# EAGLE design watch_dev (EAGLE 7.0.0)
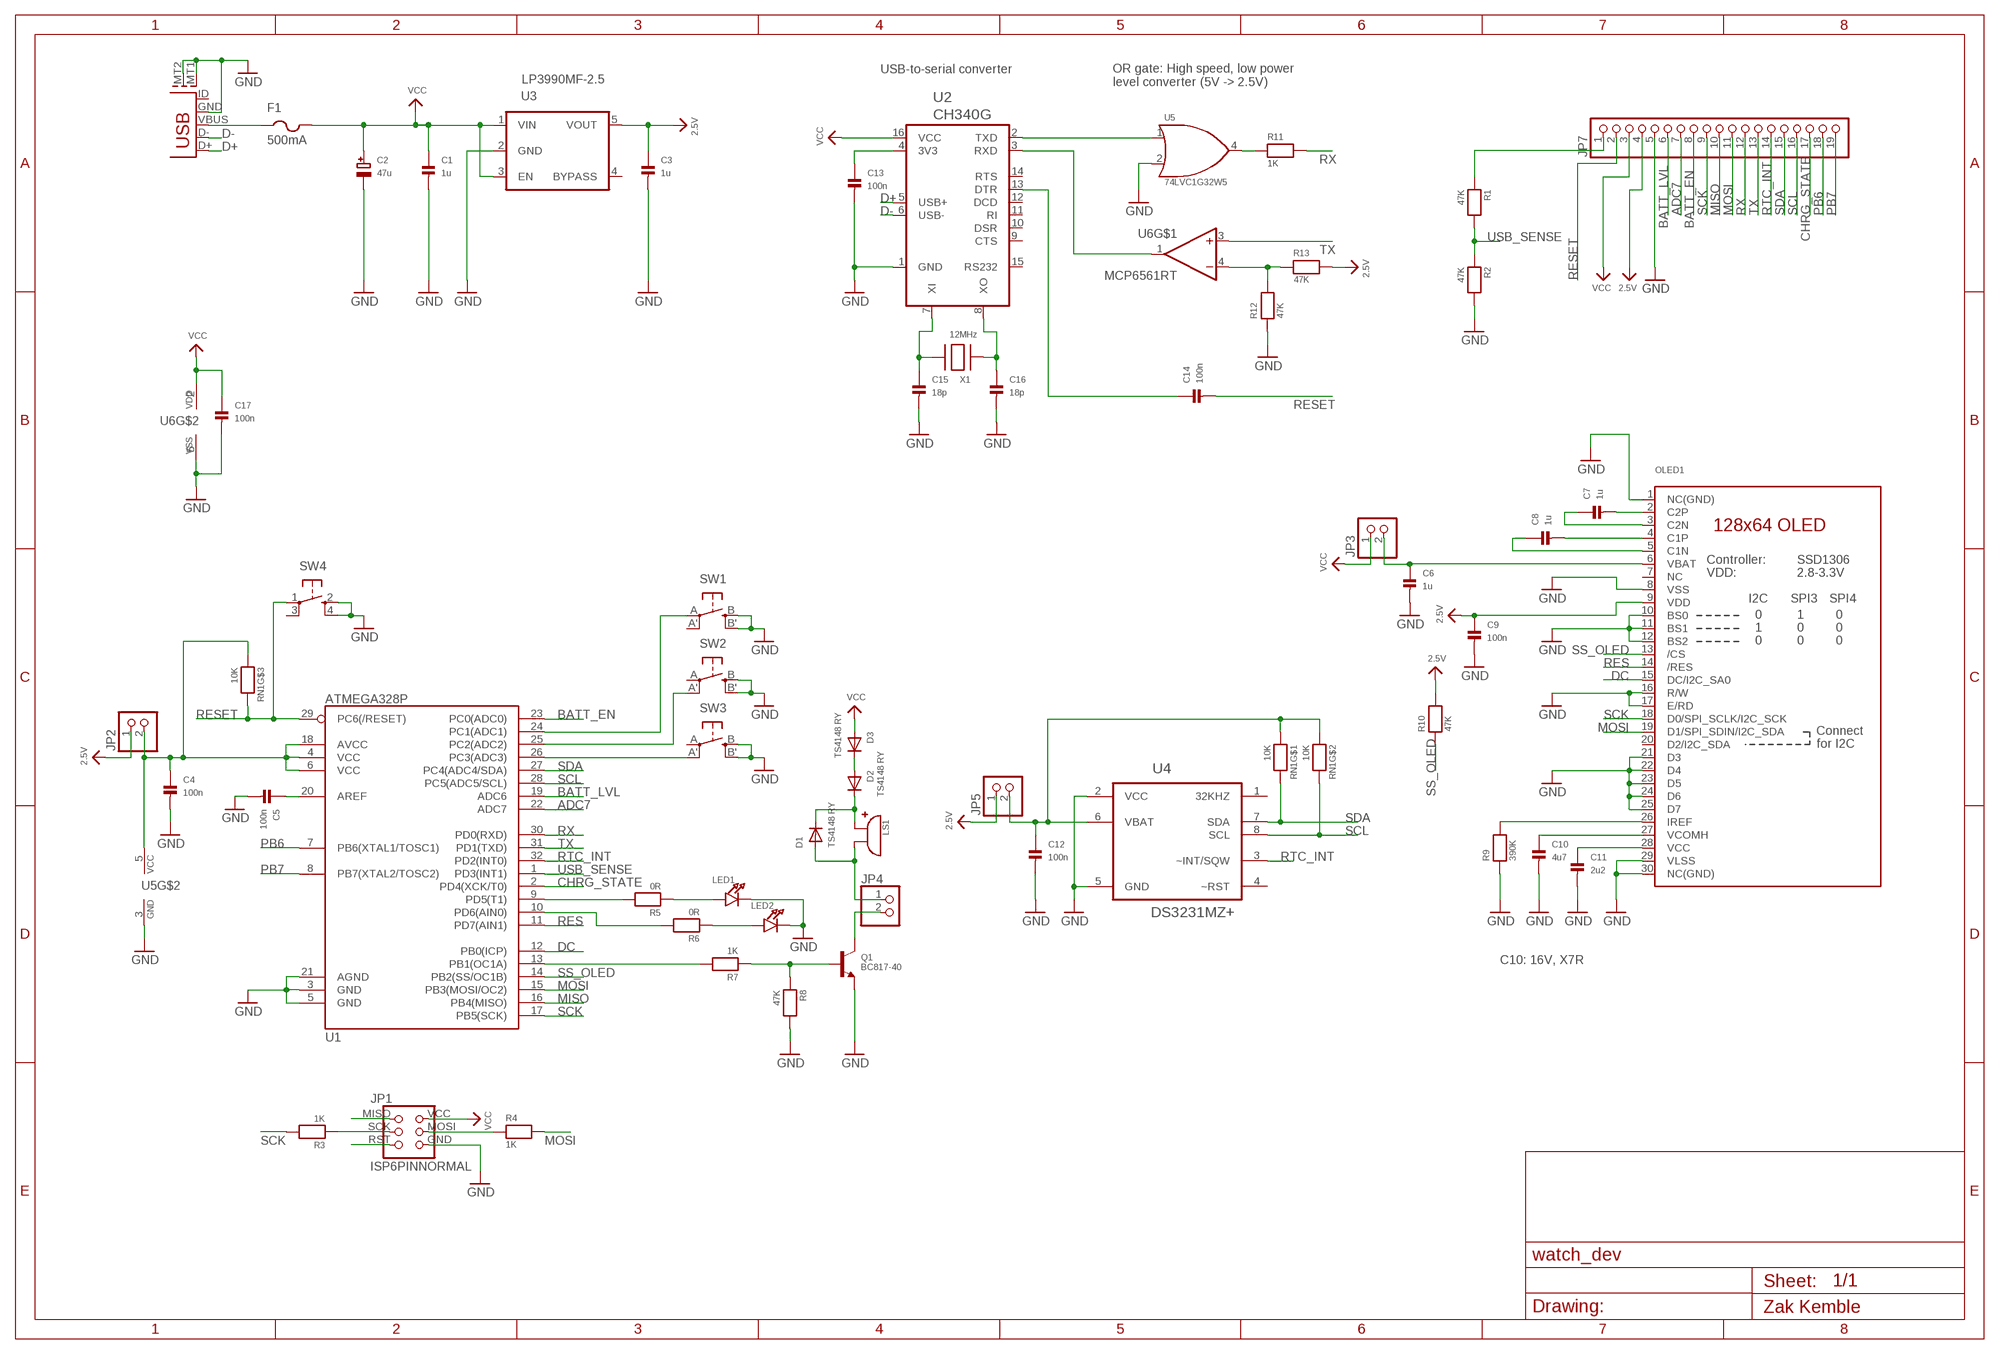
[diagram p0: schematic, sheet 1]

## Parts
C1  1u  CAP_CERAMIC0805  [0805]
C2  47u  CAP_ELECTROLYTICPANASONIC_C  [PANASONIC_C]
C3  1u  CAP_CERAMIC0805  [0805]
C4  100n  CAP_CERAMIC0805  [0805]
C5  100n  CAP_CERAMIC0805  [0805]
C6  1u  CAP_CERAMIC0805  [0805]
C7  1u  CAP_CERAMIC0805  [0805]
C8  1u  CAP_CERAMIC0805  [0805]
C9  100n  CAP_CERAMIC0805  [0805]
C10  4u7  CAP_CERAMIC0805  [0805]
C11  2u2  CAP_CERAMIC0805  [0805]
C12  100n  CAP_CERAMIC0805  [0805]
C13  100n  CAP_CERAMIC0805  [0805]
C14  100n  CAP_CERAMIC0805  [0805]
C15  18p  CAP_CERAMIC0805  [0805]
C16  18p  CAP_CERAMIC0805  [0805]
C17  100n  CAP_CERAMIC0805  [0805]
D1  TS4148 RY  DIODE_08050805  [0805_DIODE]
D2  TS4148 RY  DIODE_08050805  [0805_DIODE]
D3  TS4148 RY  DIODE_08050805  [0805_DIODE]
F1  500mA  PTCFUSE1206  [1206]
JP1  ISP6PINNORMAL  [ISP6PIN]
JP2  PINHD-1X2  [1X02]
JP3  PINHD-1X2  [1X02]
JP4  PINHD-1X2  [1X02]
JP5  PINHD-1X2  [1X02]
JP7  PINHD-1X19  [1X19]
LED1  LED0805  [CHIPLED_0805]
LED2  LED0805  [CHIPLED_0805]
LS1  ABMT-801-RC  [PIEZO]
OLED1  DISP_OLED_UG-2864HSWEG01_NOOUTLINE  [UG-2864HSWEG01_1.3_WRAPAROUND]
Q1  BC817-40  TRANSISTOR_NPNWIDE  [SOT23-WIDE]
R1  47K  RESISTOR0805  [0805]
R2  47K  RESISTOR0805  [0805]
R3  1K  RESISTOR0805  [0805]
R4  1K  RESISTOR0805  [0805]
R5  0R  RESISTOR0805  [0805]
R6  0R  RESISTOR0805  [0805]
R7  1K  RESISTOR0805  [0805]
R8  47K  RESISTOR0805  [0805]
R9  390K  RESISTOR0805  [0805]
R10  47K  RESISTOR0805  [0805]
R11  1K  RESISTOR0805  [0805]
R12  47K  RESISTOR0805  [0805]
R13  47K  RESISTOR0805  [0805]
RN1  10K  RESISTOR_4PACK  [RESPACK_4X0603]
SW1  SPST_TACTMC32882  [TACT_SMD4]
SW2  SPST_TACTMC32882  [TACT_SMD4]
SW3  SPST_TACTMC32882  [TACT_SMD4]
SW4  SPST_TACTKMR2  [KMR2]
U1  ATMEGA328P  ATMEGA328_SMT  [TQFP32-08]
U2  CH340G  CH340GSMPAD  [SOIC16_SMPAD]
U3  LP3990MF-2.5  REGULATOR_5  [SOT95P275X110-5N]
U4  DS3231MZ+  DS3231MZ+SMPAD  [SOIC8_150MIL_SMPAD]
U5  74LVC1G32W5  [SOT95P275X110-5N]
U6  MCP6561RT  OPAMP_SINGLECONFIG2  [SOT95P275X110-5N]
USB1  USB-MICROBLARGEPAD  [USB-MICROB_LARGEPAD]
X1  12MHz  XTALNX5032  [NX5032]

## Nets
2.5V: C3.1 C9.1 JP2.1 JP5.1 JP7.4 OLED1.9(VDD) R10.2 R13.2 U3.5(VOUT)
ADC7: JP7.7 U1.22(ADC7)
BATT_EN: JP7.8 U1.23(PC0(ADC0))
BATT_LVL: JP7.6 U1.19(ADC6)
CHRG_STATE: JP7.17 U1.2(PD4(XCK/T0))
D+: U2.5(USB+) USB1.D+
D-: U2.6(USB-) USB1.D-
DC: OLED1.15(DC/I2C_SA0) U1.12(PB0(ICP))
GND: C1.2 C2.- C3.2 C4.2 C5.2 C6.2 C9.2 C10.2 C11.2 C12.2 C13.2 C15.2 C16.2 C17.2 JP1.GND JP7.5 LED1.C LED2.C OLED1.1(NC(GND)) OLED1.8(VSS) OLED1.10(BS0) OLED1.11(BS1) OLED1.12(BS2) OLED1.16(R/W) OLED1.17(E/RD) OLED1.21(D3) OLED1.22(D4) OLED1.23(D5) OLED1.24(D6) OLED1.25(D7) OLED1.29(VLSS) OLED1.30(NC(GND)) Q1.2(E) R2.2 R8.2 R9.1 R12.1 SW1.B'(S1) SW1.B(S) SW2.B'(S1) SW2.B(S) SW3.B'(S1) SW3.B(S) SW4.2(S) SW4.4(S1) U1.3(GND) U1.5(GND) U1.21(AGND) U2.1(GND) U3.2(GND) U4.2(VCC) U4.5(GND) U5.2(B) U5.3(GND) U6.5(VSS) USB1.GND USB1.MT1(SHEILD1) USB1.MT2(SHEILD2)
MISO: JP1.MISO JP7.10 U1.16(PB4(MISO))
MOSI: JP7.11 OLED1.19(D1/SPI_SDIN/I2C_SDA) R4.2 U1.15(PB3(MOSI/OC2))
N$1: C5.1 U1.20(AREF)
N$2: SW1.A(P) U1.24(PC1(ADC1))
N$3: C7.2 OLED1.2(C2P)
N$4: SW3.A'(P1) U1.26(PC3(ADC3))
N$5: OLED1.26(IREF) R9.2
N$6: JP7.1 R1.1
N$7: D1.1(A) JP4.1 LS1.2(GND)
N$8: Q1.1(B) R7.1 R8.1
N$9: SW2.A'(P1) U1.25(PC2(ADC2))
N$10: F1.1 USB1.VBUS
N$11: R5.2 U1.9(PD5(T1))
N$12: C6.1 JP3.2 OLED1.6(VBAT)
N$13: C8.1 OLED1.5(C1N)
N$14: C8.2 OLED1.4(C1P)
N$15: C7.1 OLED1.3(C2N)
N$16: R6.2 U1.10(PD6(AIN0))
N$17: C4.1 JP2.2 RN1.3 U1.4(VCC) U1.6(VCC) U1.18(AVCC) U5.5(VCC)
N$18: JP4.2 Q1.3(C)
N$19: C10.1 OLED1.27(VCOMH)
N$20: C11.1 OLED1.28(VCC)
N$21: C15.1 U2.7(XI) X1.P$2
N$22: JP1.SCK R3.1
N$23: C16.1 U2.8(XO) X1.P$1
N$24: JP1.MOSI R4.1
N$25: C13.1 U2.4(3V3)
N$26: U2.2(TXD) U5.1(A)
N$27: R11.1 U5.4(Y)
N$28: LED1.A R5.1
N$29: LED2.A R6.1
N$30: C14.1 U2.13(DTR)
N$31: C12.1 JP5.2 RN1.1 RN1.2 U4.6(VBAT)
N$32: D1.2(C) D2.2(C) LS1.1(VCC)
N$33: D2.1(A) D3.2(C)
N$34: U2.3(RXD) U6.1(OUT)
N$36: R12.2 R13.1 U6.4(-IN)
PB6: JP7.18 U1.7(PB6(XTAL1/TOSC1))
PB7: JP7.19 U1.8(PB7(XTAL2/TOSC2))
PIEZO: R7.2 U1.13(PB1(OC1A))
RES: OLED1.14(/RES) U1.11(PD7(AIN1))
RESET: C14.2 JP1.RST JP7.2 RN1.6 SW4.1(P) U1.29(PC6(/RESET))
RTC_INT: JP7.14 U1.32(PD2(INT0)) U4.3(~INT/SQW)
RX: JP7.12 R11.2 U1.30(PD0(RXD))
SCK: JP7.9 OLED1.18(D0/SPI_SCLK/I2C_SCK) R3.2 U1.17(PB5(SCK))
SCL: JP7.16 RN1.7 U1.28(PC5(ADC5/SCL)) U4.8(SCL)
SDA: JP7.15 RN1.8 U1.27(PC4(ADC4/SDA)) U4.7(SDA)
SS_OLED: OLED1.13(/CS) R10.1 U1.14(PB2(SS/OC1B))
TX: JP7.13 U1.31(PD1(TXD)) U6.3(+IN)
USB_SENSE: R1.2 R2.1 U1.1(PD3(INT1))
VCC: C1.1 C2.+ C17.1 D3.1(A) F1.2 JP1.VCC JP3.1 JP7.3 U2.16(VCC) U3.1(VIN) U3.3(EN) U6.2(VDD)
Unconnected: OLED1.7(NC) OLED1.20(D2/I2C_SDA) RN1.4 RN1.5 SW1.A'(P1) SW2.A(P) SW3.A(P) SW4.3(P1) U2.9(CTS) U2.10(DSR) U2.11(RI) U2.12(DCD) U2.14(RTS) U2.15(RS232) U3.4(BYPASS) U4.1(32KHZ) U4.4(~RST) USB1.ID

## Notes on the sheet
- USB-to-serial converter
- OR gate: High speed, low power
  level converter (5V -> 2.5V)
- C10: 16V, X7R

## Library data of the parts
C1 C3-C17 = microbuilder:CAP_CERAMIC: Ceramic Capacitors 0402 - 0402 Surface Mount Capacitors 16pF 50V 5% [Digikey: 445-4899-2-ND] 18pF 50V 5% [Digikey: 490-1281-2-ND] 22pF 50V 5% [Digikey: 490-1283-2-ND] 68pF 50V 5% [Digikey: 490-1289-2-ND] 0.1uF 10V 10% [Digikey: 490-1318-2-ND] 1.0uF 6.3V 10% [Digikey: 490-1320-2-ND] 0603 - 0603 Surface Mount Capacitors 16 pF 50V 5% [Digikey: 445-5051-2-ND] 22 pF 50V [Digikey: PCC220ACVTR-ND] 33 pF 50V 5% [Digikey: 490-1415-1-ND] 56pF 50V 5% [Digikey: 490-1421-1-ND] 220pF 50V 5% [Digikey: 445-1285-1-ND] 680 pF 50V 2200 pF 50V 5% C0G [Digikey: 445-1297-1-ND] 5600 pF 100V 5% X7R [Digikey: 478-3711-1-ND] 0.1 µF 25V 10% [Digikey: PCC2277TR-ND] 0.22 µF 16V 10% X7R [Digikey: 445-1318-1-ND] 1.0 µF 25V 10% [Digikey: 445-5146-2-ND] 0603 - RF Specific 3pF 250V +/-0.1pF RF [Digikey: 712-1347-1-ND] 18 pF 250V 5% [Digikey: 478-3505-1-ND or 712-1322-1-ND] 56 pF 250V 5% C0G RF [Digikey: 490-4867-1-ND] 68 pF 250V RF [Digikey: 490-4868-1-ND] 0805 - 0805 Surface Mount Capacitors 220 pF 250V 2% RF Ceramic Capacitor [Digikey: 712-1398-1-ND] 1000 pF 50V 2% NP0 Ceramic Capacitor [Digikey: 478-3760-1-ND] 0.1 µF 25V 10% Ceramic Capacitor [Digikey: PCC1828TR-ND] 1.0 µF 16V 10% Ceramic Capacitor[Digikey: 490-1691-2-ND] 10.0 µF 10V 10% Ceramic Capacitor[Digikey: 709-1228-1-ND] 10.0 uF 16V 10% Ceramic Capacitor [Digikey: 478-5165-2-ND] 47 uF 6.3V 20% Ceramic Capacitor [Digikey: 587-1779-1-ND or 399-5506-1-ND] 1206 - 1206 Surface Mount Capacitors 47uF 10V 20% Ceramic Capacitor [Digikey: 490-5528-1-ND or 399-5508-1-ND or 445-6010-1-ND] 100uF 6.3V -20%, +80% Y5V Ceramic Capacitor (Digikey: 490-4512-1-ND, Mouser: 81-GRM31CF50J107ZE1L)
C2 = zak:CAP_ELECTROLYTIC
D1-D3 = zak:DIODE_0805: Diode in 0805 package
F1 = zak:PTCFUSE
JP1 = zak:ISP6PIN
JP2-JP5 = pinhead:PINHD-1X2: PIN HEADER
JP7 = pinhead:PINHD-1X19: PIN HEADER
LED1 LED2 = microbuilder:LED: LED 0603 - 0603 Surface Mount Package 2mA: Green LED - Low Power (3.9mcd, 2ma, 1.7Vf) - Digikey: 475-2709-2-ND Orange LED - Low Power (9.8mcd, 2ma, 1.8Vf) - Digikey: 475-1194-2-ND Red LED - Low Power (5mcd, 2ma, 1.8Vf) - Digikey: 475-1195-2-ND Yellow LED - Low Power (7mcd, 2ma, 1.8Vf) - Digikey: 475-1196-2-ND 5mA: Blue LED - Low Power (17mcd, 5ma, 2.9Vf) - Digikey: LNJ937W8CRACT-ND 0805 - 0805 Surface Mount Package 2mA: Red LED (8.8mcd, 2mA, 1.8Vf, Clear) - Low Power [Digikey: 475-2510-1-ND] Green LED (5mcd, 2mA, 1.8Vf, Clear) - Low Power [Digikey: 475-2730-1-ND] Yellow LED (11.3mcd, 2mA, 1.8Vf, Clear) - Low Power [Digikey: 475-2555-1-ND] 20mA: Red LED (104mcd, 20mA, Diffused) - LS R976 [Digikey: 475-1278-6-ND] Red LED (12mcd, 20mA, 2.0Vf, Clear) - APT2012EC [Digikey: 754-1128-1-ND] Green LED (15mcd, 20mA, 2.2Vf, Clear) - APT2012GC [Digikey: 754-1131-1-ND] Orange LED (160mcd, 20mA, 2.1Vf, Clear) - APT2012SECK [Digikey: 754-1130-1-ND] 1206 - 1206 Surface Mount Package Green LED (26mcd, 20mA, Diffused) - LG N971 [Digikey: 475-1407-6-ND] Red LED (15mcd, 20mA, Diffused) - LH N974 [Digikey: 475-1416-6-ND]
LS1 = zak:ABMT-801-RC
OLED1 = zak:DISP_OLED_UG-2864HSWEG01_NOOUTLINE
Q1 = microbuilder:TRANSISTOR_NPN: NPN Transistor Transistor (NPN) 500mA 45V - BC817 [Digikey: 568-1631-1-ND] Transistor (NPN) 500mA 45V - BC817,215 [Mouser: 771-BC817-T/R] SOT23-R - SOT23 footprint optimised for use with solder paste and reflow ovens. SOT23-W - SOT23 footprint optimised for hand-soldering (larger pads).
R1-R13 = microbuilder:RESISTOR: Resistors 0402 - 0402 Surface Mount Package 22 Ohm 1% 1/16W [Digikey: 311-22.0LRTR-ND] 33 Ohm 5% 1/16W 1.0K 5% 1/16W 1.5K 5% 1/16W 2.0K 1% 1/16W 10.0K 1% 1/16W [Digikey: 311-10.0KLRTR-ND] 10.0K 5% 1/16W [Digikey: RMCF0402JT10K0TR-ND] 12.1K 1% 1/16W [Digikey: 311-22.0LRTR-ND] 100.0K 5% 1/16W 0603 - 0603 Surface Mount Package 0 Ohm 1/10 Watt 1% Resistor 15 Ohm 1/10 Watt 1% Resistor 33 Ohm 1/10 Watt 1% Resistor 49.9 Ohm 1/10 Watt 1% Resistor 100 Ohm 1/10 Watt 1% Resistor 150 Ohm 1/10 Watt 1% Resistor 240 Ohm 1/10 Watt 1% Resistor 390 Ohm 1/10 Watt 1% Resistor 560 Ohm 1/10 Watt 1% Resistor 680 Ohm 1/10 Watt 1% Resistor 750 Ohm 1/10 Watt 1% Resistor 1.0K Ohm 1/10 Watt 1% Resistor 1.5K Ohm 1/10 Watt 1% Resistor 2.0K Ohm 1/10 Watt 1% Resistor 2.2K Ohm 1/10 Watt 1% Resistor 3.3K Ohm 1/10 Watt 1% Resistor 4.7K Ohm 1/10 Watt 1% Resistor 10.0K Ohm 1/10 Watt 1% Resistor 12.0K Ohm 1/10 Watt 1% Resistor 12.1K Ohm 1/10 Watt 1% Resistor 20.0K Ohm 1/10 Watt 1% Resistor 33.0K Ohm 1/10 Watt 1% Resistor 100.0K Ohm 1/10 Watt 1% Resistor 0805 - 0805 Surface Mount Package 0 Ohm 1/8 Watt 1% Resistor 33 Ohm 1/8 Watt 1% Resistor 100 Ohm 1/8 Watt 1% Resistor 150 Ohm 1/8 Watt 1% Resistor 200 Ohm 1/8 Watt 1% Resistor 240 Ohm 1/8 Watt 1% Resistor 330 Ohm 1/8 Watt 1% Resistor 390 Ohm 1/8 Watt 1% Resistor 470 Ohm 1/8 Watt 1% Resistor 1.0K Ohm 1/8 Watt 1% Resistor 1.5K Ohm 1/8 Watt 1% Resistor 2.0K Ohm 1/8 Watt 1% Resistor 4.7K Ohm 1/8 Watt 1% Resistor 5.1K Ohm 1/8 Watt 1% Resistor 5.6K Ohm 1/8 Watt 1% Resistor 10.0K Ohm 1/8 Watt 1% Resistor 22.0K Ohm 1/8 Watt 1% Resistor 33.0K Ohm 1/8 Watt 1% Resistor 100K Ohm 1/8 Watt 1% Resistor 1206 - 1206 Surface Mount Package 2012 - 2010 Surface Mount Package 0.11 Ohm 1/2 Watt 1% Resistor - Digikey: RHM.11UCT-ND
RN1 = microbuilder:RESISTOR_4PACK: Resistor Packs (4 resistors) 4 x 0603 10K 1/16W - Digikey: YC164J-10KCT-ND
SW1-SW4 = zak:SPST_TACT
U1 = SparkFun-DigitalIC:ATMEGA328_SMT: 32-Pin Atmega328 part Commonly used on Arduino compatible boards Available in QFP and QFN packages TQFP is IC-09069 QFN is non-stock; PROD_ID: IC-09069
U2 = zak:CH340G
U3 = zak:REGULATOR_5
U4 = zak:DS3231MZ+
U5 = zak:74LVC1G32W5
U6 = zak:OPAMP_SINGLE
USB1 = zak:USB-MICROB
X1 = zak:XTAL

## Board
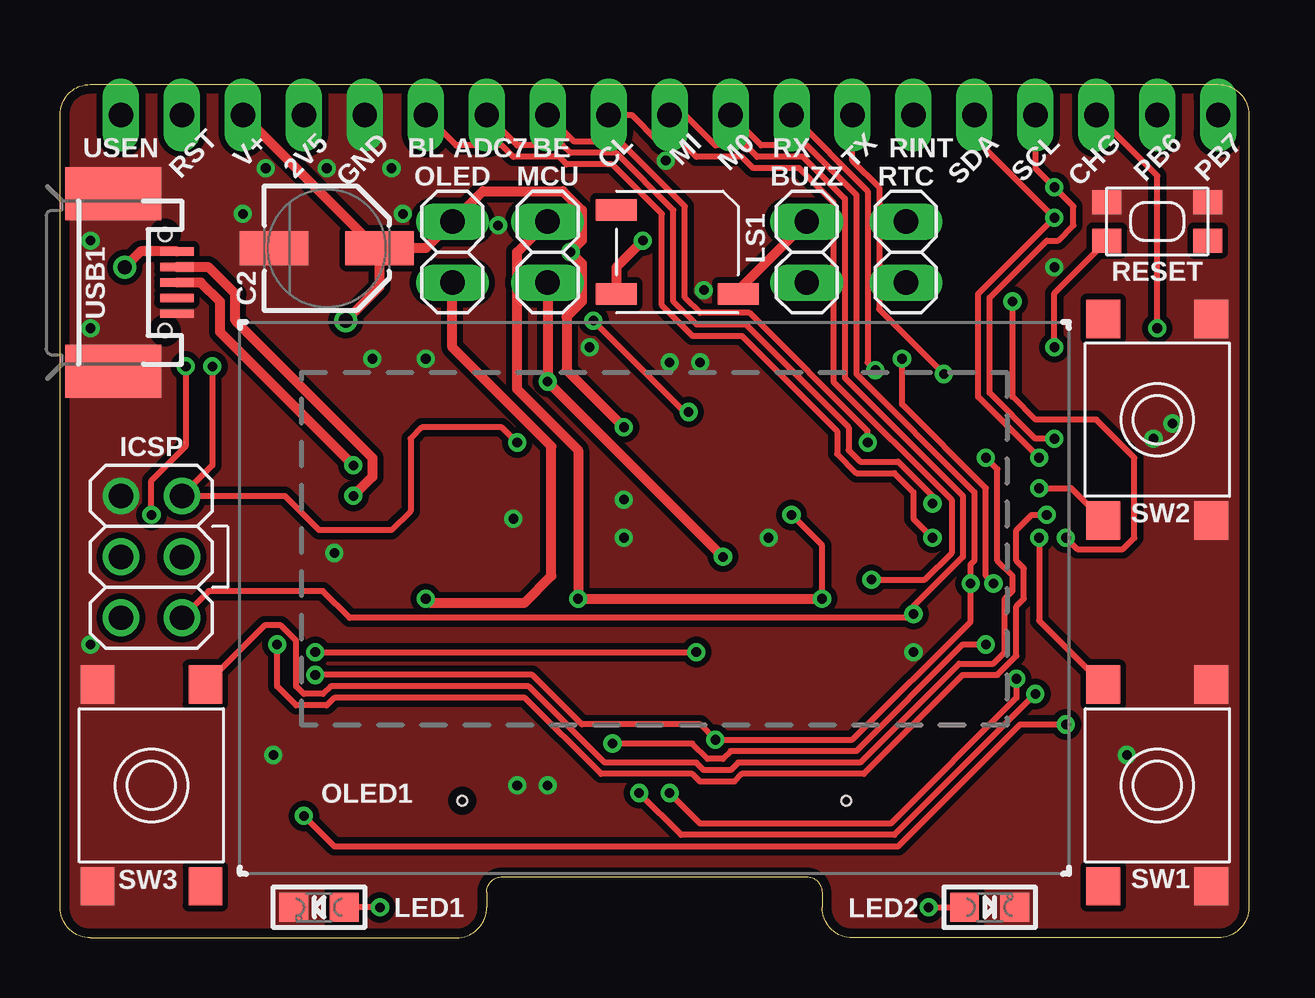
[diagram p1: board, top side]
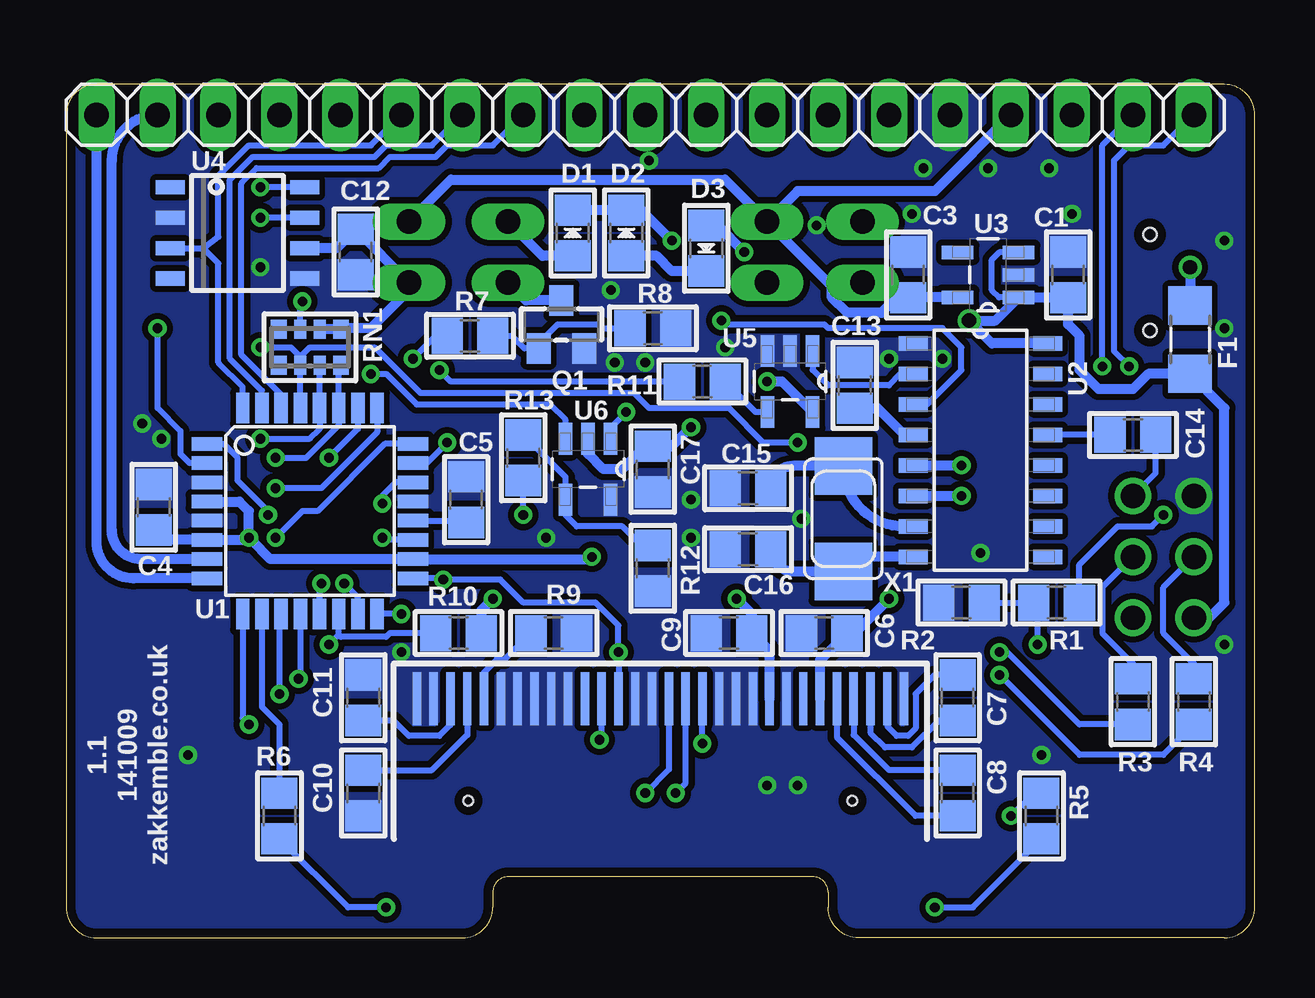
[diagram p2: board, bottom side, seen from below]

Size 49.53 x 35.56 mm. Coordinates in mm from the lower left corner, seen from the top.
Outline: 48.26,35.56 arc-90 49.53,34.29 49.53,1.27 arc-90 48.26,0 33.02,0 arc-90 31.75,1.27 31.75,1.91 arc90 31.11,2.54 18.41,2.54 arc90 17.78,1.91 17.78,1.27 arc-90 16.51,0 1.27,0 arc-90 0,1.27 0,34.29 arc-90 1.27,35.56 48.26,35.56
Copper layers (1*16): Top 0.0356mm / dielectric 1.5011mm / Bottom 0.0356mm
Design rules "LaenPCBOrder *": minimum track width 6mil, minimum drill 13mil, track to track 6mil, track to pad 6mil, pad to pad 6mil, via to via 6mil, smd to smd 6mil, copper to edge 15mil, drill to drill 6mil, minimum pad ring 7mil, minimum via ring 7mil, stop-mask expansion 4mil, vias tented up to drill 24mil, thermal gap 10mil

### Footprints (pad centres in the part's own frame; a part is rotated, then mirrored left to right if it is on the bottom)
0805 = smd 1.3 x 1.5: 1 -0.95,0; 2 0.95,0
PANASONIC_C = smd 2.85 x 1.4: + 2.2,0; - -2.2,0
0805_DIODE = smd 1.3 x 1.5: 1 -0.95,0; 2 0.95,0
1206 = smd 1.6 x 1.803: 1 -1.422,0; 2 1.422,0
ISP6PIN = drill 1.016 pad 1.53: GND -2.54,-1.27; MISO 2.54,1.27; MOSI 0,-1.27; RST -2.54,1.27; SCK 0,1.27; VCC 2.54,-1.27
1X02 = drill 1.016 long: 1 -1.27,0; 2 1.27,0
1X19 = drill 1.016 long: 1 -22.86,0; 2 -20.32,0; 3 -17.78,0; 4 -15.24,0; 5 -12.7,0; 6 -10.16,0; 7 -7.62,0; 8 -5.08,0; 9 -2.54,0; 10 0,0; 11 2.54,0; 12 5.08,0; 13 7.62,0; 14 10.16,0; 15 12.7,0; 16 15.24,0; 17 17.78,0; 18 20.32,0; 19 22.86,0
CHIPLED_0805 = smd 1.2 x 1.2: A 0,-1.05; C 0,1.05
PIEZO = smd 1.7 x 0.9: 1 -2.54,-1.75; 2 2.54,-1.75; 3 -2.54,1.75
UG-2864HSWEG01_1.3_WRAPAROUND = smd 0.35 x 2.2 bottom: 1 -10.15,-0.2; 2 -9.45,-0.2; 3 -8.75,-0.2; 4 -8.05,-0.2; 5 -7.35,-0.2; 6 -6.65,-0.2; 7 -5.95,-0.2; 8 -5.25,-0.2; 9 -4.55,-0.2; 10 -3.85,-0.2; 11 -3.15,-0.2; 12 -2.45,-0.2; 13 -1.75,-0.2; 14 -1.05,-0.2; 15 -0.35,-0.2; 16 0.35,-0.2; 17 1.05,-0.2; 18 1.75,-0.2; 19 2.45,-0.2; 20 3.15,-0.2; 21 3.85,-0.2; 22 4.55,-0.2; 23 5.25,-0.2; 24 5.95,-0.2; 25 6.65,-0.2; 26 7.35,-0.2; 27 8.05,-0.2; 28 8.75,-0.2; 29 9.45,-0.2; 30 10.15,-0.2 | hole 0.4: -8,-4.45; 8,-4.45
SOT23-WIDE = smd 1 x 1.27: 1 -0.95,-1; 2 0.95,-1; 3 0,1
RESPACK_4X0603 = smd 0.65 x 0.8: 1 -1.3,-0.75; 4 1.3,-0.75; 5 1.3,0.75; 8 -1.3,0.75 | smd 0.5 x 0.8: 2 -0.4,-0.75; 3 0.4,-0.75; 6 0.4,0.75; 7 -0.4,0.75
TACT_SMD4 = smd 1.6 x 1.4: A -4.2,-2.25; A' 4.2,-2.25; B -4.2,2.25; B' 4.2,2.25
KMR2 = smd 1.2 x 1: 1 2.1,0.8; 2 2.1,-0.8; 3 -2.1,0.8; 4 -2.1,-0.8
TQFP32-08 = smd 1.27 x 0.559: 1 -4.293,2.8; 2 -4.293,2; 3 -4.293,1.2; 4 -4.293,0.4; 5 -4.293,-0.4; 6 -4.293,-1.2; 7 -4.293,-2; 8 -4.293,-2.8; 17 4.293,-2.8; 18 4.293,-2; 19 4.293,-1.2; 20 4.293,-0.4; 21 4.293,0.4; 22 4.293,1.2; 23 4.293,2; 24 4.293,2.8 | smd 0.559 x 1.27: 9 -2.8,-4.293; 10 -2,-4.293; 11 -1.2,-4.293; 12 -0.4,-4.293; 13 0.4,-4.293; 14 1.2,-4.293; 15 2,-4.293; 16 2.8,-4.293; 25 2.8,4.293; 26 2,4.293; 27 1.2,4.293; 28 0.4,4.293; 29 -0.4,4.293; 30 -1.2,4.293; 31 -2,4.293; 32 -2.8,4.293
SOIC16_SMPAD = smd 1.2 x 0.6: 1 -2.8,4.445; 2 -2.8,3.175; 3 -2.8,1.905; 4 -2.8,0.635; 5 -2.8,-0.635; 6 -2.8,-1.905; 7 -2.8,-3.175; 8 -2.8,-4.445; 9 2.8,-4.445; 10 2.8,-3.175; 11 2.8,-1.905; 12 2.8,-0.635; 13 2.8,0.635; 14 2.8,1.905; 15 2.8,3.175; 16 2.8,4.445
SOT95P275X110-5N = smd 1.321 x 0.559: 1 -1.27,0.94; 2 -1.27,0; 3 -1.27,-0.94; 4 1.27,-0.94; 5 1.27,0.94
SOIC8_150MIL_SMPAD = smd 0.6 x 1.2: 1 -1.905,-2.8; 2 -0.635,-2.8; 3 0.635,-2.8; 4 1.905,-2.8; 5 1.905,2.8; 6 0.635,2.8; 7 -0.635,2.8; 8 -1.905,2.8
USB-MICROB_LARGEPAD = smd 0.35 x 1.4: D+ 0,2.65; D- -0.65,2.65; GND 1.3,2.65; ID 0.65,2.65; VBUS -1.3,2.65 | smd 2.2 x 4: MT1 -3.7,0; MT2 3.7,0 | hole 0.55: -2,2.15; 2,2.15
NX5032 = smd 2.4 x 2.4: P$1 2.2,0; P$2 -2.2,0

### Placement (x,y rotation side)
C1  7.78,27.62 90 bottom
C2  11.11,28.73 0 top
C3  14.45,27.62 90 bottom
C4  45.88,17.94 90 bottom
C5  32.86,18.26 90 bottom
C6  17.94,12.7 180 bottom
C7  12.38,10 90 bottom
C8  12.38,6.03 90 bottom
C9  21.91,12.7 180 bottom
C10  37.15,6.03 270 bottom
C11  37.15,10 90 bottom
C12  37.47,28.57 270 bottom
C13  16.67,23.02 90 bottom
C14  5.08,20.95 0 bottom
C15  21.11,18.73 180 bottom
C16  21.11,16.19 180 bottom
C17  25.08,19.53 270 bottom
D1  28.42,29.37 90 bottom
D2  26.19,29.37 90 bottom
D3  22.86,28.73 270 bottom
F1  2.7,24.92 270 bottom
JP1  3.81,15.88 270 top
JP2  20.32,28.57 270 top
JP3  16.35,28.57 270 top
JP4  31.11,28.57 270 top
JP5  35.24,28.57 270 top
JP7  25.4,34.29 180 bottom
LED1  10.79,1.27 90 top
LED2  38.73,1.27 270 top
LS1  25.72,28.57 0 top
OLED1  24.77,10.16 0 top
Q1  28.89,25.56 0 bottom
R1  8.26,13.97 180 bottom
R2  12.22,13.97 180 bottom
R3  5.08,9.84 270 bottom
R4  2.54,9.84 270 bottom
R5  8.89,5.08 90 bottom
R6  40.64,5.08 90 bottom
R7  32.7,25.08 180 bottom
R8  25.08,25.4 0 bottom
R9  29.21,12.7 180 bottom
R10  33.18,12.7 0 bottom
R11  23.02,23.18 180 bottom
R12  25.08,15.4 90 bottom
R13  30.48,20 270 bottom
RN1  39.37,24.61 180 bottom
SW1  45.72,6.35 270 top
SW2  45.72,21.59 270 top
SW3  3.81,6.35 90 top
SW4  45.72,29.84 180 top
U1  39.37,17.78 0 bottom
U2  11.43,20.32 0 bottom
U3  11.11,27.62 180 bottom
U4  42.39,29.37 270 bottom
U5  19.37,23.18 270 bottom
U6  27.78,19.53 270 bottom
USB1  2.22,27.3 270 top
X1  17.14,17.46 270 bottom

### Tracks (layer width: path | path; a pad name or v marks a point on that pad's centre or on a via)
2.5V  (via drill 0.4)
  Top 0.254: v31.75,14.13 31.75,16.35 v30.48,17.62
  Top 0.406: v31.75,14.13 v21.59,14.13 21.59,20.32 19.05,22.86 19.05,28.57 JP2.1
  Bottom 0.254: v30.48,17.62 R13.2
  Bottom 0.406: U3.5 14.12,26.68 C3.1 14.92,26.67 15.56,26.04 16.99,26.04 17.62,26.67 17.62,27.15 JP2.1 | OLED1.9 20.21,11.96 C9.1 20.96,13.5 v21.59,14.13 | v31.75,14.13 32.23,13.65 R10.2 | JP5.1 33.5,31.59 22.07,31.59 JP2.1 | JP2.1 19.05,31.11 13.34,31.11 JP7.4
ADC7  (via drill 0.4)
  Top 0.254: JP7.7 19.05,33.02 20.95,33.02 21.27,32.7 23.18,32.7 25.56,30.32 25.56,26.51 26.51,25.56 28.57,25.56 32.86,21.27 32.86,20.32 33.34,19.84 34.92,19.84 36.35,18.41 v36.35,18.1
  Bottom 0.254: v36.35,18.1 36.35,18.41 35.79,18.98 U1.22
BATT_EN  (via drill 0.4)
  Top 0.254: JP7.8 21.43,33.18 23.34,33.18 26.04,30.48 26.04,26.67 26.67,26.04 28.73,26.04 33.66,21.11 v33.66,20.64
  Bottom 0.254: v33.66,20.64 34.51,19.78 U1.23
BATT_LVL  (via drill 0.4)
  Top 0.254: JP7.6 16.51,33.02 18.41,33.02 18.89,32.54 20.8,32.54 21.11,32.23 23.02,32.23 25.08,30.16 25.08,26.35 26.35,25.08 28.42,25.08 32.38,21.11 32.38,20.16 33.18,19.37 34.77,19.37 35.56,18.57 35.56,17.46 v36.35,16.67
  Bottom 0.254: U1.19 36.27,16.58 v36.35,16.67
CHRG_STATE  (via drill 0.4)
  Top 0.254: v45.72,25.4 45.72,31.75 JP7.17
  Bottom 0.254: U1.2 44.39,19.78 44.77,20.16 44.77,21.11 45.72,22.07 v45.72,25.4
D+  (via drill 0.4)
  Top 0.406: USB1.D+ 5.87,27.3 6.67,26.51 6.67,25.24 v12.22,19.68
  Bottom 0.406: U2.5 v12.22,19.68
D-  (via drill 0.4)
  Top 0.406: USB1.D- 6.18,27.95 7.3,26.83 7.3,25.72 13.02,20 13.02,19.21 v12.22,18.41
  Bottom 0.406: U2.6 v12.22,18.41
DC  (via drill 0.4)
  Top 0.254: v39.85,10.79 39.85,10 34.61,4.76 26.67,4.76 v25.4,6.03
  Bottom 0.254: U1.12 39.77,10.87 v39.85,10.79 | v25.4,6.03 24.41,7.02 OLED1.15
GND  (via drill 0.4)
  other vias: 35.56,11.91 15.24,24.13 45.56,20.8 46.35,21.43 23.5,16.67 13.02,24.13 22.07,24.61 25.4,23.97 26.67,23.97 19.05,6.35 20.32,6.35 23.5,18.26 29.53,16.67 26.83,26.99 7.62,30.16 8.57,32.07 11.11,32.07 13.81,32.07 8.89,7.62 1.27,12.22 44.45,7.62 1.27,25.4 1.27,29.05 25.24,32.38 11.43,16.03 18.26,29.69 14.29,30.16 41.43,27.94 18.89,17.46
  pour Bottom (isolate 0.254, no thermals): 0,35.56 49.53,35.56 49.53,0 0,0
  pour Top (isolate 0.254, no thermals): 0,35.56 49.53,35.56 49.53,0 0,0
MISO  (via drill 0.4)
  Top 0.254: JP1.MISO 6.19,14.45 10.95,14.45 12.06,13.34 35.4,13.34 v35.56,13.49 35.56,13.81 37.62,15.88 37.62,18.41 32.7,23.34 32.7,30.8 30.96,32.54 29.05,32.54 28.57,33.02 27.3,33.02 26.04,34.29 JP7.10
  Bottom 0.254: v35.56,13.49 U1.16
MOSI  (via drill 0.4)
  Top 0.254: v10.64,10.95 19.68,10.95 21.75,8.89 26.67,8.89 v27.3,8.26 33.02,8.26 37.94,13.18 v37.94,14.76 37.94,15.56 38.1,15.72 38.1,18.57 33.18,23.5 33.18,30.96 31.11,33.02 29.21,33.02 JP7.11
  Bottom 0.254: v27.3,8.26 27.21,8.35 OLED1.19 | U1.15 37.37,14.19 v37.94,14.76 | R4.2 3.81,7.62 7.3,7.62 v10.64,10.95
N$1
  Bottom 0.254: U1.20 32.94,17.38 C5.1
N$2  (via drill 0.4)
  Top 0.254: v40.8,16.67 40.8,13.22 SW1.A
  Bottom 0.254: U1.24 36.25,20.58 39.05,17.78 39.69,17.78 v40.8,16.67
N$3
  Bottom 0.254: C7.2 13.34,10.95 14.13,10.16 14.13,8.73 14.45,8.41 14.92,8.41 15.31,8.81 OLED1.2
N$4  (via drill 0.4)
  Top 0.254: v38.58,20 39.05,19.53 39.05,15.72 39.69,15.08 39.69,14.45 39.37,14.13 39.37,11.91 38.89,11.43 37.47,11.43 33.34,7.3 28.26,7.3 27.94,6.99 26.83,6.99 26.51,7.3 22.7,7.3 19.53,10.48 11.27,10.48 10.95,10.16 10.16,10.16 9.84,10.48 9.84,12.38 9.21,13.02 8.53,13.02 SW3.A'
  Bottom 0.254: U1.26 37.37,21.21 v38.58,20
N$5
  Bottom 0.254: OLED1.26 32.12,11.06 31.59,11.59 31.27,11.59 R9.2
N$6  (via drill 0.4)
  Top 0.254: v3.81,17.62 3.81,19.05 5.24,20.48 v5.24,23.81
  Bottom 0.254: R1.1 7.3,15.55 5.71,17.14 4.29,17.14 v3.81,17.62 | v5.24,23.81 5.87,24.45 5.87,32.38 5.24,33.02 3.81,33.02 JP7.1
N$7
  Top 0.406: LS1.2 28.26,26.99 JP4.1
  Bottom 0.406: D1.1 29.69,28.42 JP4.1
N$8
  Bottom 0.254: R7.1 30.95,25.08 30.43,24.56 Q1.1 29.84,24.77 29.05,25.56 27.3,25.56 27.15,25.4 R8.1
N$9  (via drill 0.4)
  Top 0.254: v40.8,18.73 42.13,18.73 SW2.A'
  Bottom 0.254: U1.25 36.57,21.06 38.89,18.73 v40.8,18.73
N$10  (via drill 0.6)
  Top 0.406: USB1.VBUS 3.36,28.61 v2.7,27.94
  Bottom 0.406: v2.7,27.94 F1.1
N$11  (via drill 0.4)
  Top 0.254: v10.16,5.08 11.43,3.81 34.92,3.81 40.01,8.89 v41.91,8.89
  Bottom 0.254: U1.9 42.17,9.15 v41.91,8.89 | R5.2 9.21,6.03 v10.16,5.08
N$12  (via drill 0.4)
  Top 0.406: JP3.2 16.35,24.61 20.48,20.48 20.48,15.08 19.37,13.97 15.4,13.97 v15.24,14.13
  Bottom 0.406: OLED1.6 18.11,11.57 C6.1 16.67,12.7 v15.24,14.13
N$13
  Bottom 0.254: OLED1.5 17.41,8.37 14.13,5.08 C8.1
N$14
  Bottom 0.254: OLED1.4 16.71,8.46 15.24,6.98 C8.2
N$15
  Bottom 0.254: C7.1 13.17,9.05 14.29,7.94 15.4,7.94 16.02,8.55 OLED1.3
N$16
  Bottom 0.254: U1.10 41.37,9.62 40.64,8.89 R6.2
N$17  (via drill 0.4)
  Top 0.254: v39.69,26.51 39.69,22.54 40.64,21.59 43.18,21.59 44.77,20 44.77,16.67 44.29,16.19 42.39,16.19 v41.91,16.67
  Top 0.406: JP2.2 v20.32,23.18 v27.62,15.88
  Bottom 0.254: RN1.3 39.77,26.43 v39.69,26.51
  Bottom 0.406: U1.4 42.31,18.18 41.91,17.78 v41.91,16.67 41.91,16.58 | U5.5 19.7,23.18 v20.32,23.18 | C4.1 45.47,16.58 U1.6 41.91,16.58 | v27.62,15.88 27.72,15.78 U1.18 41.02,15.78 41.82,16.58 41.91,16.58
N$18
  Bottom 0.406: Q1.3 30.37,26.56 JP4.2
N$19
  Bottom 0.254: OLED1.27 32.81,8.46 34.29,6.98 C10.1
N$20
  Bottom 0.254: OLED1.28 33.52,8.87 33.97,8.41 35.24,8.41 35.88,9.05 36.99,9.05 C11.1
N$21
  Bottom 0.406: U2.7 14.63,17.14 arc90 X1.P$2 19.23,19.66 arc-90 C15.1
N$22
  Bottom 0.254: JP1.SCK 6.35,14.61 6.35,12.7 5.08,11.43 R3.1
N$23
  Bottom 0.406: U2.8 16.53,15.88 arc-90 X1.P$1 19.23,15.26 arc90 C16.1
N$24
  Bottom 0.254: R4.1 2.54,11.43 3.81,12.7 3.81,14.61 JP1.MOSI
N$25
  Bottom 0.406: U2.4 14.61,20.95 15.72,22.07 C13.1
N$26
  Bottom 0.254: U2.2 14.76,23.5 15.24,23.02 17.78,23.02 18.43,23.67 U5.1
N$27
  Bottom 0.254: U5.4 20.8,21.91 R11.1
N$28  (via drill 0.4)
  Top 0.254: v13.34,1.27 LED1.A
  Bottom 0.254: v13.34,1.27 11.75,1.27 R5.1
N$29  (via drill 0.4)
  Top 0.254: v36.2,1.27 LED2.A
  Bottom 0.254: v36.2,1.27 37.78,1.27 R6.1
N$30
  Bottom 0.254: C14.1 U2.13
N$31
  Bottom 0.406: RN1.2 RN1.1 38.03,25.4 36.83,25.4 35.24,26.99 JP5.2 C12.1 38.26,28.73 U4.6
N$32  (via drill 0.4)
  Top 0.406: v24.29,29.05 23.18,27.94 LS1.1
  Bottom 0.406: D1.2 D2.2 25.56,30.32 v24.29,29.05
N$33
  Bottom 0.406: D3.2 24.29,27.78 24.92,28.42 D2.1
N$34  (via drill 0.4)
  Top 0.254: v26.19,21.91 26.04,21.91 v22.23,25.72
  Bottom 0.254: U2.3 13.65,22.23 12.22,23.65 12.22,24.61 13.02,25.4 17.78,25.4 17.94,25.56 22.07,25.56 v22.23,25.72 | U6.1 26.84,21.26 v26.19,21.91
N$36
  Bottom 0.254: R12.2 25.56,16.35 26.35,17.14 28.26,17.14 28.72,17.61 U6.4 28.72,19.19 R13.1
PB6
  Bottom 0.406: U1.7 46.42,15.78 arc90 47.62,16.99 47.62,32.38 arc90 JP7.18
PB7
  Bottom 0.406: U1.8 46.73,14.98 arc90 48.26,16.51 JP7.19
PIEZO  (via drill 0.4)
  Top 0.254: v38.89,14.76 38.58,15.08 38.58,18.73 35.08,22.23 v35.08,24.13
  Bottom 0.254: U1.13 38.97,14.69 v38.89,14.76 | R7.2 34.13,25.08 v35.08,24.13
RES  (via drill 0.4)
  Top 0.254: v40.64,10.16 34.77,4.29 25.88,4.29 v24.13,6.03
  Bottom 0.254: U1.11 40.64,13.42 v40.64,10.16 | v24.13,6.03 23.71,6.45 OLED1.14
RESET  (via drill 0.4)
  Top 0.254: v19.05,20.64 18.41,21.27 15.08,21.27 14.61,20.8 14.61,17.78 13.81,16.99 10.79,16.99 9.37,18.41 JP1.RST 6.35,19.68 v6.35,23.81 | v41.43,24.61 41.43,26.86 SW4.1
  Bottom 0.254: U1.29 RN1.6 39.77,24.21 | v41.43,24.61 40.16,24.61 39.77,24.21 | 39.77,24.21 39.37,24.61 36.67,24.61 34.77,22.7 25.88,22.7 25.24,22.07 21.91,22.07 20.48,20.64 v19.05,20.64 | v6.35,23.81 6.35,33.02 JP7.2 | JP1.RST 4.13,19.36 C14.2
RTC_INT
  Bottom 0.254: U1.32 42.17,22.96 43.18,23.97 43.18,28.1 43.81,28.73 | JP7.14 36.83,33.02 41.91,33.02 43.18,31.75 43.18,29.21 43.81,28.73 | U4.3 43.81,28.73
RX  (via drill 0.4)
  Top 0.254: JP7.12 33.66,31.11 33.66,23.97 v33.97,23.65
  Bottom 0.254: U1.30 40.57,22.63 42.23,24.29 42.23,31.43 41.59,32.07 36.51,32.07 36.04,32.54 34.13,32.54 33.66,33.02 31.75,33.02 JP7.12 | R11.2 33.5,23.18 v33.97,23.65
SCK  (via drill 0.4)
  Top 0.254: v10.64,11.91 v26.51,11.91 | v33.81,14.92 36.04,14.92 37.15,16.03 37.15,18.26 32.23,23.18 32.23,30.64 30.8,32.07 28.89,32.07 28.42,32.54 26.51,32.54 25.88,33.18 24.92,33.18 23.81,34.29 JP7.9
  Bottom 0.254: U1.17 33.87,14.98 v33.81,14.92 31.43,14.92 30.48,13.97 27.46,13.97 26.52,13.02 v26.52,11.91 v26.51,11.91 OLED1.18 | v10.64,11.91 10.32,11.91 7.3,8.89 R3.2
SCL  (via drill 0.4)
  Top 0.254: v41.43,20.8 40.64,20.8 38.73,22.7 38.73,26.67 41.12,29.05 41.59,29.05 42.23,29.69 42.23,30.48 v41.43,31.27 40.64,32.07 JP7.16
  Bottom 0.254: v41.43,20.8 39.37,20.8 38.97,21.2 U1.28 RN1.7 | U4.8 v41.43,31.27
SDA  (via drill 0.4)
  Top 0.254: v40.8,20 38.26,22.54 38.26,26.83 v41.43,30 38.1,33.34 JP7.15
  Bottom 0.254: v40.8,20 39.53,20 38.17,21.36 U1.27 38.17,23.76 RN1.8 | U4.7 v41.43,30
SS_OLED  (via drill 0.4)
  Top 0.254: v23.02,8.1 26.35,8.1 26.99,7.46 27.62,7.46 27.94,7.78 33.18,7.78 37.62,12.22 v38.58,12.22
  Bottom 0.254: v23.02,8.1 OLED1.13 | R10.1 36.04,12.7 36.2,12.54 38.08,12.54 38.17,12.63 | v38.58,12.22 38.17,12.63 | 38.17,12.63 U1.14
TX  (via drill 0.4)
  Top 0.254: JP7.13 33.02,32.38 34.13,31.27 34.13,26.19 v36.83,23.5
  Bottom 0.254: U1.31 41.37,22.8 42.7,24.13 42.7,31.59 41.75,32.54 36.67,32.54 36.2,33.02 34.29,33.02 JP7.13 | v36.83,23.5 36.2,23.5 34.92,22.23 29.37,22.23 28.72,21.58 U6.3
USB_SENSE  (via drill 0.4)
  Top 0.254: v9.05,12.22 9.05,10.48 9.84,9.68 11.11,9.68 11.43,10 19.37,10 22.54,6.83 26.35,6.83 26.67,6.51 28.1,6.51 28.42,6.83 33.5,6.83 37.62,10.95 39.05,10.95 39.85,11.75 39.85,13.81 40.16,14.13 40.16,15.4 39.85,15.72 39.85,16.99 40.48,17.62 v41.12,17.62
  Bottom 0.254: v41.12,17.62 41.12,17.78 42.39,19.05 42.39,20 42.96,20.58 U1.1 | R2.1 R1.2 9.05,13.81 v9.05,12.22
VCC  (via drill 0.4, 0.6)
  Top 0.406: v11.91,25.72 13.31,27.12 C2.+ | JP7.3 13.18,28.73 C2.+ | C2.+ 15.24,28.73 JP3.1 17.62,31.11 20.95,31.11 21.75,30.32 21.75,29.05 v21.27,28.57 21.75,28.1 21.75,26.51 21.11,25.88 21.11,23.65 v23.5,21.27
  Bottom 0.254: U3.3 10.65,28.56 10.95,28.26 10.95,26.99 10.65,26.68 U3.1
  Bottom 0.406: U2.16 10.95,24.77 v11.91,25.72 10.81,25.72 U3.1 C1.1 7.78,25.56 7.3,25.08 7.3,23.65 6.51,22.86 5.08,22.86 4.44,23.5 F1.2 1.27,22.07 1.27,13.97 1.91,13.34 JP1.VCC | D3.1 22.38,29.68 v21.27,28.57 | U6.2 27.78,20.16 27.15,19.53 26.35,19.53 25.4,20.48 C17.1 24.29,20.48 v23.5,21.27

### Text on the board
tPlace: USEN | RST | V+ | 2V5 | GND | BL | ADC7 | BE | CL | MI | M0 | RX | TX | RINT | SDA | SCL | CHG | PB6 | PB7 | OLED | MCU | BUZZ | RTC | RESET | ICSP
bPlace: zakkemble.co.uk | 141009 | 1.1
tStop: N|WatchDev